# EAGLE board EEZ DIB SMX46 r1B3 (EAGLE 7.2.0)
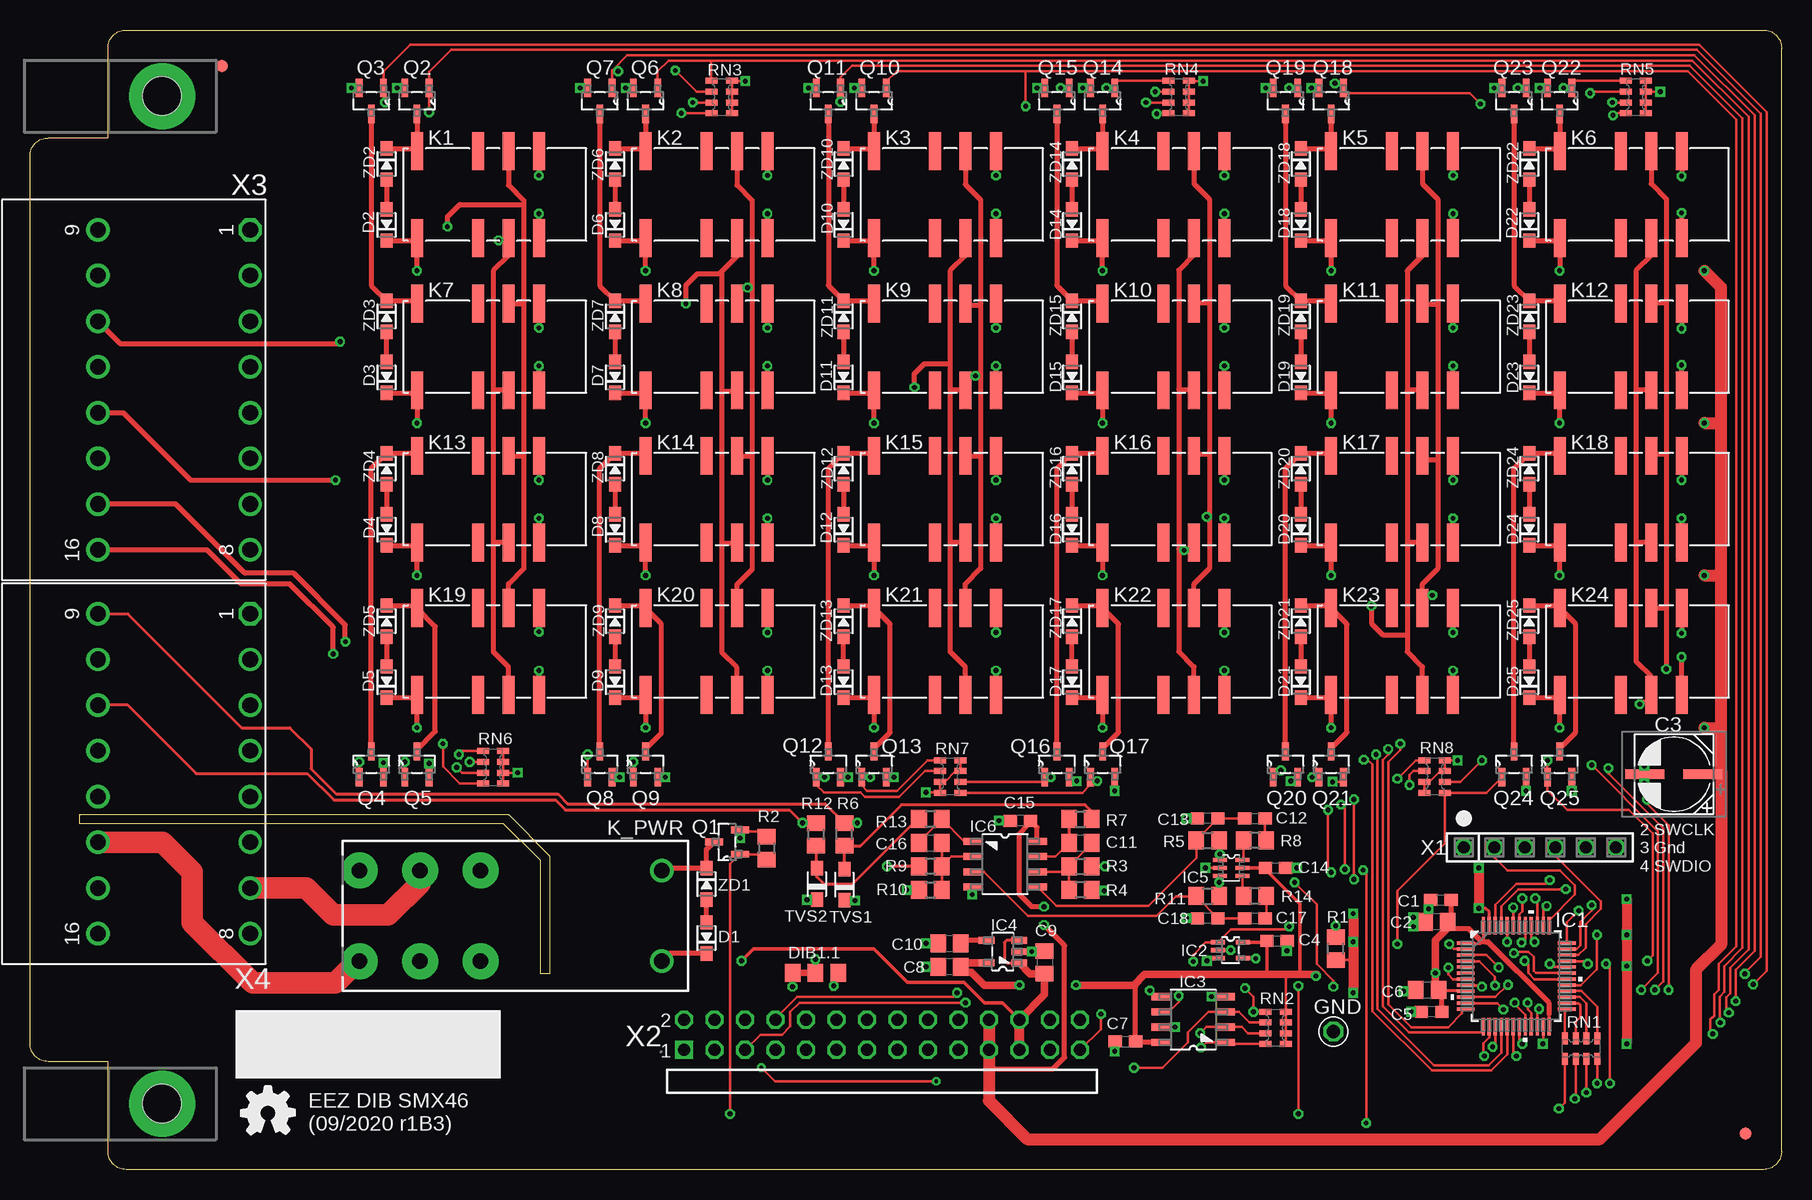
[diagram p3: board, top side]
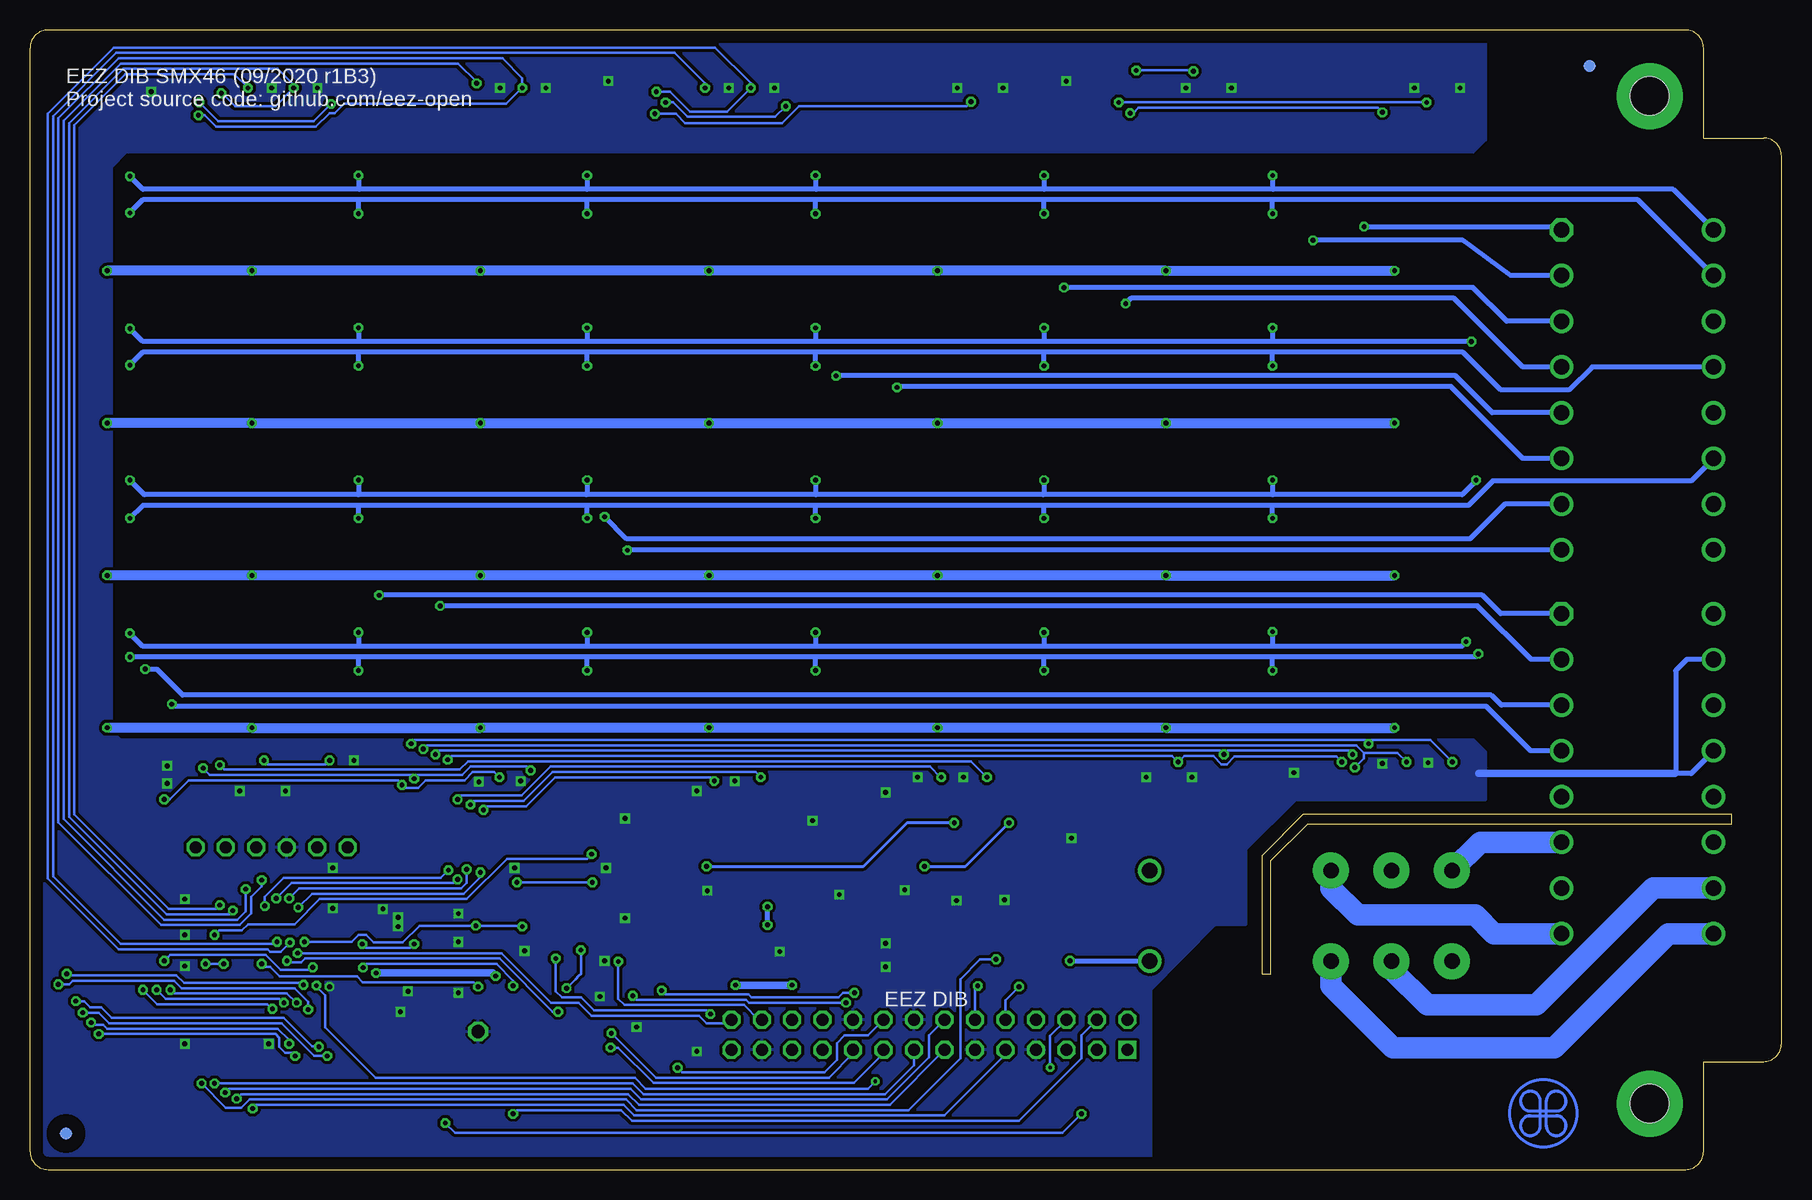
[diagram p4: board, bottom side, seen from below]

Size 146 x 95 mm. Coordinates in mm from the lower left corner, seen from the top.
Outline: 8,95 144.5,95 arc-90 146,93.5 146,1.5 arc-90 144.5,0 8,0 arc-90 6.5,1.5 6.5,9 1.5,9 arc-90 0,10.5 0,84.5 arc-90 1.5,86 6.5,86 6.5,93.5 arc-90 8,95
Outline: 4.13,29.59 39.88,29.59 43.31,26.16 43.31,16.32 42.55,16.32 42.55,25.78 39.5,28.83 4.13,28.83 4.13,29.59
Copper layers (1*16): Top 0.035mm / dielectric 1.5mm / Bottom 0.035mm
Design rules "default *": minimum track width 6mil, minimum drill 0.3mm, track to track 6mil, track to pad 6mil, pad to pad 6mil, via to via 6mil, smd to smd 6mil, copper to edge 40mil, drill to drill 8mil, minimum pad ring 4mil, minimum via ring 8mil, stop-mask expansion 2.5mil, vias tented up to drill 1mm, thermal gap 8mil
Net classes: 0 default: width 0.203 mm, drill 0.3 mm, clearance 0.203 mm; 1 lvds: width 0.152 mm, drill 0.3 mm, clearance 0.152 mm to class 0, clearance 0.152 mm; 2 gnd: width 0.254 mm, drill 0.584 mm, clearance 0.254 mm; 3 diff_in: width 0.254 mm, drill 0.584 mm, clearance 0.203 mm to class 0, clearance 0.203 mm to class 1, clearance 0.203 mm to class 2, clearance 0.203 mm
vRestrict: area 0,0 to 42,14; area 53,0 to 128,8.5

## Footprints (pad centres in the part's own frame; a part is rotated, then mirrored left to right if it is on the bottom)
C0603 = smd 1.1 x 1: 1 -0.85,0; 2 0.85,0
C0805 = smd 1.3 x 1.5: 1 -0.95,0; 2 0.95,0
CAPAE660X610N = smd 3.251 x 0.762: 1 -2.413,0; 2 2.413,0
SOD323-R = smd 1.2 x 1: A 1.3,0; C -1.3,0
JP3-0805-CUT2 = smd 1.3 x 1.5: COM 0,0; NC 1.9,0; NO -1.9,0
FIDUCIAL_DUAL = smd 1.016 x 1.016 bottom: B 0,0 | smd 1.016 x 1.016: T 0,0
PCB_SHIELD_TAB = drill 1.1 octagon: 1 0,0
LQFP-48 = smd 1.473 x 0.279: 1 -4.216,2.743; 2 -4.216,2.261; 3 -4.216,1.753; 4 -4.216,1.245; 5 -4.216,0.762; 6 -4.216,0.254; 7 -4.216,-0.254; 8 -4.216,-0.762; 9 -4.216,-1.245; 10 -4.216,-1.753; 11 -4.216,-2.261; 12 -4.216,-2.743; 25 4.216,-2.743; 26 4.216,-2.261; 27 4.216,-1.753; 28 4.216,-1.245; 29 4.216,-0.762; 30 4.216,-0.254; 31 4.216,0.254; 32 4.216,0.762; 33 4.216,1.245; 34 4.216,1.753; 35 4.216,2.261; 36 4.216,2.743 | smd 0.279 x 1.473: 13 -2.743,-4.216; 14 -2.261,-4.216; 15 -1.753,-4.216; 16 -1.245,-4.216; 17 -0.762,-4.216; 18 -0.254,-4.216; 19 0.254,-4.216; 20 0.762,-4.216; 21 1.245,-4.216; 22 1.753,-4.216; 23 2.261,-4.216; 24 2.743,-4.216; 37 2.743,4.216; 38 2.261,4.216; 39 1.753,4.216; 40 1.245,4.216; 41 0.762,4.216; 42 0.254,4.216; 43 -0.254,4.216; 44 -0.762,4.216; 45 -1.245,4.216; 46 -1.753,4.216; 47 -2.261,4.216; 48 -2.743,4.216
SOT65P210X110-5N = smd 1.168 x 0.356: 1 -1.041,0.66; 2 -1.041,0; 3 -1.041,-0.66; 4 1.041,-0.66; 5 1.041,0.66
SOIC127P600X173-8N = smd 1.55 x 0.6: 1 -2.7,1.9; 2 -2.7,0.63; 3 -2.7,-0.64; 4 -2.7,-1.91; 5 2.7,-1.91; 6 2.7,-0.64; 7 2.7,0.63; 8 2.7,1.9
SOT95P270X145-5N = smd 1.321 x 0.559: 1 -1.372,0.94; 2 -1.372,0; 3 -1.372,-0.94; 4 1.372,-0.94; 5 1.372,0.94
SOT65P210X110-6N = smd 1.168 x 0.356: 1 -0.94,0.66; 2 -0.94,0; 3 -0.94,-0.66; 4 0.94,-0.66; 5 0.94,0; 6 0.94,0.66
FTR-C1 = smd 1 x 3.16: 1 -6.35,-3.62; 3 -1.27,-3.62; 4 1.27,-3.62; 5 3.81,-3.62; 8 3.81,3.62; 9 1.27,3.62; 10 -1.27,3.62; 12 -6.35,3.62
RT-C/016A5_ROUND = drill 1.3 pad 3: 11A 8.83,3.78; 11B 8.83,-3.78; 12A 3.79,3.78; 12B 3.79,-3.78; 14A 13.87,3.78; 14B 13.87,-3.78 | drill 1.3: A1 -11.33,-3.78; A2 -11.33,3.78
PCB-MB = hole 3.2: 0,0
SOT103P240X110-3N = smd 1.524 x 0.559: 1 -1.079,1.016; 2 -1.079,-1.016; 3 1.079,0
R0805 = smd 1.3 x 1.5: 1 -0.95,0; 2 0.95,0
CAY16 = smd 0.5 x 1: 1 -1.35,-0.85; 2 -0.45,-0.85; 3 0.45,-0.85; 4 1.35,-0.85; 5 1.35,0.85; 6 0.45,0.85; 7 -0.45,0.85; 8 -1.35,0.85
SOD323-BIDIR = smd 1.2 x 1: 1 -1.3,0; 2 1.3,0
SSW-106-02-S-S = drill 1 pad 1.5 octagon: 1 -6.35,0; 2 -3.81,0; 3 -1.27,0; 4 1.27,0; 5 3.81,0; 6 6.35,0
77317-104-28LF = drill 1 pad 1.5 square: 1 -33.02,-2.54 | drill 1 pad 1.5 octagon: 2 -33.02,0; 3 -30.48,-2.54; 4 -30.48,0; 5 -27.94,-2.54; 6 -27.94,0; 7 -25.4,-2.54; 8 -25.4,0; 9 -22.86,-2.54; 10 -22.86,0; 11 -20.32,-2.54; 12 -20.32,0; 13 -17.78,-2.54; 14 -17.78,0; 15 -15.24,-2.54; 16 -15.24,0; 17 -12.7,-2.54; 18 -12.7,0; 19 -10.16,-2.54; 20 -10.16,0; 21 -7.62,-2.54; 22 -7.62,0; 23 -5.08,-2.54; 24 -5.08,0; 25 -2.54,-2.54; 26 -2.54,0; 27 0,-2.54; 28 0,0
691327310016 = drill 1.3 octagon: 1 -13.335,6.35 | drill 1.3: 2 -9.525,6.35; 3 -5.715,6.35; 4 -1.905,6.35; 5 1.905,6.35; 6 5.715,6.35; 7 9.525,6.35; 8 13.335,6.35; 9 -13.335,-6.35; 10 -9.525,-6.35; 11 -5.715,-6.35; 12 -1.905,-6.35; 13 1.905,-6.35; 14 5.715,-6.35; 15 9.525,-6.35; 16 13.335,-6.35

## Placement (x,y rotation side)
C1  100n  [C0603]  117.6,22.48 0 top
C2  2u2  [C0805]  117.22,20.64 180 top
C3  EEEFK1V470P  [CAPAE660X610N]  137.03,32.96 180 top
C4  100n  [C0603]  103.95,19.05 0 top
C5  100n  [C0603]  116.84,13.14 180 top
C6  2u2  [C0805]  116.46,14.99 0 top
C7  100n  [C0603]  91.31,10.67 0 top
C8  2u2  [C0805]  76.64,16.89 180 top
C9  2u2  [C0805]  84.58,17.27 270 top
C10  10n  [C0805]  76.64,18.86 0 top
C11  100p  [C0805]  87.57,27.24 0 top
C12  100n  [C0603]  102.11,29.27 0 top
C13  100n  [C0603]  98.17,29.27 180 top
C14  100n  [C0603]  103.82,25.15 0 top
C15  100n  [C0603]  82.55,29.08 180 top
C16  100p  [C0805]  75.06,27.24 0 top
C17  100n  [C0603]  102.11,20.95 0 top
C18  100n  [C0603]  98.17,20.95 180 top
D1  BAS316  [SOD323-R]  56.39,19.3 90 top
D2  BAS316  [SOD323-R]  29.72,78.74 90 top
D3  BAS316  [SOD323-R]  29.72,66.04 90 top
D4  BAS316  [SOD323-R]  29.72,53.34 90 top
D5  BAS316  [SOD323-R]  29.72,40.64 90 top
D6  BAS316  [SOD323-R]  48.77,78.74 90 top
D7  BAS316  [SOD323-R]  48.77,66.04 90 top
D8  BAS316  [SOD323-R]  48.77,53.34 90 top
D9  BAS316  [SOD323-R]  48.77,40.64 90 top
D10  BAS316  [SOD323-R]  67.82,78.74 90 top
D11  BAS316  [SOD323-R]  67.82,66.04 90 top
D12  BAS316  [SOD323-R]  67.82,53.34 90 top
D13  BAS316  [SOD323-R]  67.82,40.64 90 top
D14  BAS316  [SOD323-R]  86.87,78.74 90 top
D15  BAS316  [SOD323-R]  86.87,66.04 90 top
D16  BAS316  [SOD323-R]  86.87,53.34 90 top
D17  BAS316  [SOD323-R]  86.87,40.64 90 top
D18  BAS316  [SOD323-R]  105.92,78.74 90 top
D19  BAS316  [SOD323-R]  105.92,66.04 90 top
D20  BAS316  [SOD323-R]  105.92,53.34 90 top
D21  BAS316  [SOD323-R]  105.92,40.64 90 top
D22  BAS316  [SOD323-R]  124.97,78.74 90 top
D23  BAS316  [SOD323-R]  124.97,66.04 90 top
D24  BAS316  [SOD323-R]  124.97,53.34 90 top
D25  BAS316  [SOD323-R]  124.97,40.64 90 top
DIB1.1  JP3-CUT-0805-ROTATED  [JP3-0805-CUT2]  65.47,16.38 180 top
EEZ_SIGNATURE  SIGNATURESMALL  [SIGNATURE_5MM]  19.86,4.68 180 top
FM1  FIDUCIAL_2  [FIDUCIAL_DUAL]  16,92 0 top
FM2  FIDUCIAL_2  [FIDUCIAL_DUAL]  143,3 0 top
GND  [PCB_SHIELD_TAB]  108.65,11.49 0 top
IC1  STM32F030C6T6  [LQFP-48]  123.89,16.13 0 top
IC2  74HC1G126GW,125  [SOT65P210X110-5N]  100.08,18.29 0 top
IC3  M24C32-WMN6P  [SOIC127P600X173-8N]  96.96,12.51 180 top
IC4  LP2985-33DBVR  [SOT95P270X145-5N]  81.09,18.16 180 top
IC5  74HC2G04GW,125  [SOT65P210X110-6N]  100.14,25.15 0 top
IC6  OPA2990IDR  [SOIC127P600X173-8N]  81.28,25.46 0 top
K1  FTR-C1GA012G-B05  [FTR-C1]  38.61,81.28 0 top
K2  FTR-C1GA012G-B05  [FTR-C1]  57.66,81.28 0 top
K3  FTR-C1GA012G-B05  [FTR-C1]  76.71,81.28 0 top
K4  FTR-C1GA012G-B05  [FTR-C1]  95.76,81.28 0 top
K5  FTR-C1GA012G-B05  [FTR-C1]  114.81,81.28 0 top
K6  FTR-C1GA012G-B05  [FTR-C1]  133.86,81.28 0 top
K7  FTR-C1GA012G-B05  [FTR-C1]  38.61,68.58 0 top
K8  FTR-C1GA012G-B05  [FTR-C1]  57.66,68.58 0 top
K9  FTR-C1GA012G-B05  [FTR-C1]  76.71,68.58 0 top
K10  FTR-C1GA012G-B05  [FTR-C1]  95.76,68.58 0 top
K11  FTR-C1GA012G-B05  [FTR-C1]  114.81,68.58 0 top
K12  FTR-C1GA012G-B05  [FTR-C1]  133.86,68.58 0 top
K13  FTR-C1GA012G-B05  [FTR-C1]  38.61,55.88 0 top
K14  FTR-C1GA012G-B05  [FTR-C1]  57.66,55.88 0 top
K15  FTR-C1GA012G-B05  [FTR-C1]  76.71,55.88 0 top
K16  FTR-C1GA012G-B05  [FTR-C1]  95.76,55.88 0 top
K17  FTR-C1GA012G-B05  [FTR-C1]  114.81,55.88 0 top
K18  FTR-C1GA012G-B05  [FTR-C1]  133.86,55.88 0 top
K19  FTR-C1GA012G-B05  [FTR-C1]  38.61,43.18 0 top
K20  FTR-C1GA012G-B05  [FTR-C1]  57.66,43.18 0 top
K21  FTR-C1GA012G-B05  [FTR-C1]  76.71,43.18 0 top
K22  FTR-C1GA012G-B05  [FTR-C1]  95.76,43.18 0 top
K23  FTR-C1GA012G-B05  [FTR-C1]  114.81,43.18 0 top
K24  FTR-C1GA012G-B05  [FTR-C1]  133.86,43.18 0 top
K_PWR  RT424005  [RT-C/016A5_ROUND]  41.34,21.15 180 top
KK1  PCB-MB  [PCB-MB]  11,89.5 0 top
KK2  PCB-MB  [PCB-MB]  11,5.5 0 top
Q1  2N7002  [SOT103P240X110-3N]  58.1,27.3 180 top
Q2  2N7002  [SOT103P240X110-3N]  32.26,89.09 270 top
Q3  2N7002  [SOT103P240X110-3N]  28.45,89.09 270 top
Q4  2N7002  [SOT103P240X110-3N]  28.45,33.78 90 top
Q5  2N7002  [SOT103P240X110-3N]  32.26,33.78 90 top
Q6  2N7002  [SOT103P240X110-3N]  51.31,89.09 270 top
Q7  2N7002  [SOT103P240X110-3N]  47.5,89.09 270 top
Q8  2N7002  [SOT103P240X110-3N]  47.5,33.78 90 top
Q9  2N7002  [SOT103P240X110-3N]  51.31,33.78 90 top
Q10  2N7002  [SOT103P240X110-3N]  70.36,89.09 270 top
Q11  2N7002  [SOT103P240X110-3N]  66.55,89.09 270 top
Q12  2N7002  [SOT103P240X110-3N]  66.55,33.78 90 top
Q13  2N7002  [SOT103P240X110-3N]  70.36,33.78 90 top
Q14  2N7002  [SOT103P240X110-3N]  89.41,89.09 270 top
Q15  2N7002  [SOT103P240X110-3N]  85.6,89.09 270 top
Q16  2N7002  [SOT103P240X110-3N]  85.6,33.78 90 top
Q17  2N7002  [SOT103P240X110-3N]  89.41,33.78 90 top
Q18  2N7002  [SOT103P240X110-3N]  108.46,89.09 270 top
Q19  2N7002  [SOT103P240X110-3N]  104.65,89.09 270 top
Q20  2N7002  [SOT103P240X110-3N]  104.65,33.78 90 top
Q21  2N7002  [SOT103P240X110-3N]  108.46,33.78 90 top
Q22  2N7002  [SOT103P240X110-3N]  127.51,89.09 270 top
Q23  2N7002  [SOT103P240X110-3N]  123.7,89.09 270 top
Q24  2N7002  [SOT103P240X110-3N]  123.7,33.78 90 top
Q25  2N7002  [SOT103P240X110-3N]  127.51,33.78 90 top
R1  10K  [R0805]  108.84,18.41 90 top
R2  47K  [R0805]  61.4,26.8 270 top
R3  10K  [R0805]  87.57,25.27 0 top
R4  4K7  [R0805]  87.57,23.3 180 top
R5  10K  [R0805]  98.17,27.43 0 top
R6  47R  [R0805]  67.88,27.94 90 top
R7  180R  [R0805]  87.57,29.21 0 top
R8  10K  [R0805]  102.11,27.43 180 top
R9  10K  [R0805]  75.06,25.27 180 top
R10  4K7  [R0805]  75.06,23.3 0 top
R11  10K  [R0805]  98.17,22.8 0 top
R12  47R  [R0805]  65.53,27.94 90 top
R13  180R  [R0805]  75.06,29.21 180 top
R14  10K  [R0805]  102.11,22.8 180 top
RN1  DR1206-33R-4/8  [CAY16]  129.29,10.1 180 top
RN2  DR1206-10K-4/8  [CAY16]  103.82,11.81 270 top
RN3  DR1206-47K-4/8  [CAY16]  57.66,89.41 90 top
RN4  DR1206-47K-4/8  [CAY16]  95.76,89.41 90 top
RN5  DR1206-47K-4/8  [CAY16]  133.86,89.41 90 top
RN6  DR1206-47K-4/8  [CAY16]  38.61,33.53 90 top
RN7  DR1206-47K-4/8  [CAY16]  76.71,32.77 90 top
RN8  DR1206-47K-4/8  [CAY16]  117.09,32.77 90 top
TVS1  PESD12VL1BA.115  [SOD323-BIDIR]  67.88,23.75 90 top
TVS2  PESD12VL1BA.115  [SOD323-BIDIR]  65.6,23.81 90 top
X1  N.C.  [SSW-106-02-S-S]  125.86,26.86 0 top
X2  77317-104-28LF  [77317-104-28LF]  87.54,12.5 0 top
X3  691327310016  [691327310016]  12,65 270 top
X4  691327310016  [691327310016]  12,33 270 top
ZD1  MM3Z18VT1G  [SOD323-R]  56.39,23.81 270 top
ZD2  MM3Z18VT1G  [SOD323-R]  29.72,83.82 270 top
ZD3  MM3Z18VT1G  [SOD323-R]  29.72,71.12 270 top
ZD4  MM3Z18VT1G  [SOD323-R]  29.72,58.42 270 top
ZD5  MM3Z18VT1G  [SOD323-R]  29.72,45.72 270 top
ZD6  MM3Z18VT1G  [SOD323-R]  48.77,83.82 270 top
ZD7  MM3Z18VT1G  [SOD323-R]  48.77,71.12 270 top
ZD8  MM3Z18VT1G  [SOD323-R]  48.77,58.42 270 top
ZD9  MM3Z18VT1G  [SOD323-R]  48.77,45.72 270 top
ZD10  MM3Z18VT1G  [SOD323-R]  67.82,83.82 270 top
ZD11  MM3Z18VT1G  [SOD323-R]  67.82,71.12 270 top
ZD12  MM3Z18VT1G  [SOD323-R]  67.82,58.42 270 top
ZD13  MM3Z18VT1G  [SOD323-R]  67.82,45.72 270 top
ZD14  MM3Z18VT1G  [SOD323-R]  86.87,83.82 270 top
ZD15  MM3Z18VT1G  [SOD323-R]  86.87,71.12 270 top
ZD16  MM3Z18VT1G  [SOD323-R]  86.87,58.42 270 top
ZD17  MM3Z18VT1G  [SOD323-R]  86.87,45.72 270 top
ZD18  MM3Z18VT1G  [SOD323-R]  105.92,83.82 270 top
ZD19  MM3Z18VT1G  [SOD323-R]  105.92,71.12 270 top
ZD20  MM3Z18VT1G  [SOD323-R]  105.92,58.42 270 top
ZD21  MM3Z18VT1G  [SOD323-R]  105.92,45.72 270 top
ZD22  MM3Z18VT1G  [SOD323-R]  124.97,83.82 270 top
ZD23  MM3Z18VT1G  [SOD323-R]  124.97,71.12 270 top
ZD24  MM3Z18VT1G  [SOD323-R]  124.97,58.42 270 top
ZD25  MM3Z18VT1G  [SOD323-R]  124.97,45.72 270 top

## Tracks (layer width: path | path; a pad name or v marks a point on that pad's centre or on a via)
+3V3  (via drill 0.4)
  Top 0.203: RN2.5 RN2.6 RN2.7 RN2.8 104.67,16.17 104.33,16.26
  Top 0.254: IC1.24 126.63,12.94 | IC1.48 121.14,19.13 121.28,18.99 | IC1.1 120.92,18.87 121.03,18.99 | 117.54,15.37 117.16,14.99 | IC1.9 117.51,14.88 C6.2
  Top 0.305: 103.06,16.26 103.1,16.3 C4.1 103.1,18.95 IC2.5 | 101.69,16.23 101.66,16.26 | IC5.5 C14.1 103,25.15 103,25.02 105.86,22.16 105.86,16.32 105.79,16.26
  Top 0.406: 126.63,12.94 126.63,13.89 121.54,18.99 121.28,18.99 121.03,18.99 119.95,20.07 118.62,20.07 C2.1 | C2.1 118.37,20.95 118.43,20.89 | IC3.8 92.22,10.61 C7.2 92.16,15.22 92.01,15.37 | 117.18,14.71 C6.2 117.69,14.71 C5.1 | C1.2 118.45,20.91 C2.1
  Top 0.61: C2.1 118.11,20.07 117.16,19.11 v117.16,16.38 117.16,14.99 C6.2 | v107.19,16.13 107.25,16.26 105.79,16.26 104.33,16.26 103.06,16.26 101.66,16.26 92.9,16.26 92.01,15.37 v87.19,15.37 | C8.1 77.59,16.7 77.78,16.7 | IC4.5 77.92,17.22 C8.1 | v82.49,15.37 79.57,15.37 78.49,16.45 77.85,16.45 77.85,16.63 C8.1
  Bottom 0.61: v87.19,15.37 v82.49,15.37 | v117.16,16.38 107.44,16.38 v107.19,16.13
+5V  (via drill 0.4)
  Top 0.254: 82.43,17.19 IC4.1 82.45,17.21 81.41,17.21 81.22,17.4 81.22,18.92 81.39,19.1 IC4.3
  Top 0.305: v59.31,17.4 60.33,18.41 70.36,18.41 73.15,15.62 77.85,15.62 79.57,13.91 81.05,13.91 X2.24
  Top 0.406: D1.C 53.31,18 K_PWR.A2
  Top 0.61: X2.24 84.58,14.62 C9.2 83.36,16.32 IC4.1
  Top 0.813: X2.23 X2.24
  Bottom 0.406: v59.31,17.4 52.7,17.4 K_PWR.A2
+12V  (via drill 0.4)
  Top 0.254: C3.1 140.72,32.96 140.97,33.21
  Top 0.406: D8.C 50.8,52.04 | 50.8,52.04 51.09,52.04 K14.1 | D10.C 70.14,77.44 K3.1 v70.36,74.93 | D23.C 127.29,64.74 K12.1 v127.51,62.23 | D19.C 108.24,64.74 K11.1 v108.46,62.23 | D15.C 89.19,64.74 K10.1 v89.41,62.23 | v32.26,62.23 K7.1 32.04,64.74 D3.C | v51.31,62.23 K8.1 51.09,64.74 D7.C | v70.36,62.23 K9.1 70.14,64.74 D11.C | v32.26,36.83 K19.1 32.04,39.34 D5.C | D25.C 127.29,39.34 K24.1 v127.51,36.83 | D21.C 108.24,39.34 K23.1 v108.46,36.83 | D17.C 89.19,39.34 K22.1 v89.41,36.83 | D13.C 70.14,39.34 K21.1 v70.36,36.83 | D9.C 51.09,39.34 K20.1 v51.31,36.83 | v32.26,49.53 K13.1 32.04,52.04 D4.C | D24.C 127.29,52.04 K18.1 v127.51,49.53 | D20.C 108.24,52.04 K17.1 v108.46,49.53 | D16.C 89.19,52.04 K16.1 v89.41,49.53 | D12.C 70.14,52.04 K15.1 v70.36,49.53 | v32.26,74.93 K1.1 32.04,77.44 D2.C | v127.51,74.93 K6.1 127.29,77.44 D22.C | v108.46,74.93 K5.1 108.24,77.44 D18.C | v89.41,74.93 K4.1 89.19,77.44 D14.C | v51.31,74.93 K2.1 51.09,77.44 D6.C | v51.31,49.53 51.31,51.53 50.8,52.04 | IC6.8 83.95,27.4 83.95,28.54 C15.1 83.29,29 83.29,28.8 82.42,27.94 82.42,22.99 83.5,21.91 v84.52,21.91 | X2.21 79.92,8.41 79.95,8.38 85.28,8.38 86.23,9.34 86.23,18.67 v84.52,20.38
  Top 1.016: 140.97,36.83 140.97,33.21 140.97,18.73 138.88,16.64 138.88,10.54 130.87,2.54 83.12,2.54 79.92,5.74 X2.21 X2.22 | 140.97,36.83 140.97,49.53 | v139.57,36.83 140.97,36.83 | v139.57,49.53 140.97,49.53 | 140.97,49.53 140.97,62.23 | 140.97,62.23 140.97,73.53 v139.57,74.93 | v139.57,62.23 140.97,62.23
  Bottom 0.406: v84.52,20.38 v84.52,21.91
  Bottom 0.813: v32.26,62.23 v51.31,62.23 v70.36,62.23 v89.41,62.23 v108.46,62.23 v127.51,62.23 v139.57,62.23 | v32.26,36.83 v51.31,36.83 v70.36,36.83 v89.41,36.83 v108.46,36.83 v127.51,36.83 v139.57,36.83 | v32.26,49.53 v51.31,49.53 v70.36,49.53 v89.41,49.53 v108.46,49.53 v127.51,49.53 v139.57,49.53 | v32.26,74.93 v51.31,74.93 v70.36,74.93 v89.41,74.93 v108.46,74.93 v127.51,74.93 v139.57,74.93
BOOT0  (via drill 0.4)
  Top 0.203: IC1.44 v123.13,18.99 | R1.2 v108.84,20.32 | v104.97,20.26 104.71,20 100.09,20 IC2.1 99.01,18.92 97.98,18.92 96.97,17.91 v96.97,17.34
  Bottom 0.203: v123.13,18.99 119.19,18.99 118.62,19.56 117.98,19.56 117.35,18.92 114.94,18.92 113.54,20.32 v108.84,20.32 105.03,20.32 v104.97,20.26 | X2.26 85.27,12.5 86.49,13.72 96.46,13.72 96.97,14.22 v96.97,17.34
DAC#1
  Top 0.203: C12.1 C13.1 97.22,27.47 R5.1 97.22,25.97 93.22,21.97 85.56,21.97 IC6.5
DAC#2
  Top 0.203: C17.1 C18.1 97.22,22.75 | R11.1 97.22,22.75 | 97.22,22.75 95.53,22.75 93.92,21.14 83.19,21.14 79.5,24.83 IC6.3
DIB_A0  (via drill 0.4)
  Top 0.203: RN2.4 99.81,10.46 IC3.1 98.05,10.61 v97.6,10.16
  Bottom 0.203: v97.6,10.16 96.97,10.16 94.02,7.21 77.32,7.21 74.84,9.69 X2.17
DIB_A1  (via drill 0.4)
  Top 0.203: RN2.3 101.54,11.37 101.02,11.88 IC3.2 98.05,11.88 v97.54,11.37
  Bottom 0.203: v97.54,11.37 93.83,7.66 79.42,7.66 77.38,9.69 X2.19
DIB_A2  (via drill 0.4)
  Top 0.203: RN2.2 101.66,12.26 100.77,13.15 IC3.3 98.24,13.15 96.52,11.43 96.52,10.6 94.4,8.48 v92.02,8.48
  Bottom 0.203: X2.18 76.16,11.18 78.11,11.18 78.74,10.54 78.74,9.13 79.77,8.1 91.64,8.1 v92.02,8.48
DIB_CSA
  Top 0.203: RN1.4 127.94,13.32 IC1.25
DIB_CSB  (via drill 0.4)
  Top 0.203: DIB1.1.NO 67.25,16.26 67.25,15.56 v66.99,15.3
  Bottom 0.203: X2.12 67.22,15.08 v66.99,15.3
DIB_IRQ  (via drill 0.4)
  Top 0.203: v63.56,15.24 DIB1.1.NC
  Bottom 0.203: X2.10 64.68,14.12 v63.56,15.24
DIB_MISO
  Top 0.203: RN1.2 129.74,13.84 129.2,14.38 IC1.27
DIB_MOSI
  Top 0.203: RN1.1 130.64,13.57 129.32,14.88 IC1.28
DIB_NRESET  (via drill 0.4)
  Top 0.203: v105.73,15.3 v105.73,4.64 | IC1.7 118.62,15.88 118.24,16.26 v118.24,16.83
  Bottom 0.203: X2.4 58.36,11.2 58.36,9.27 63.56,4.06 95.82,4.06 96.71,4.95 105.41,4.95 v105.73,4.64 | v118.24,16.83 117.92,17.14 107.12,17.14 105.73,15.75 v105.73,15.3
DIB_SCL  (via drill 0.4)
  Top 0.203: X2.5 59.62,9.96 60.9,11.24 62.67,11.24 63.37,11.94 63.37,13.14 64.14,13.91 v77.98,13.91 | IC3.6 94.94,13.15 95.76,13.97 v95.76,14.48
  Bottom 0.203: v77.98,13.91 86.04,13.91 86.3,14.16 95.44,14.16 v95.76,14.48
DIB_SCLK
  Top 0.203: RN1.3 128.84,12.31 129.22,12.7 129.22,13.72 129.07,13.87 IC1.26
DIB_SDA  (via drill 0.4)
  Top 0.203: X2.8 62.14,12.61 63.94,14.41 76.96,14.41 v77.28,14.73 | IC3.5 93.85,14.42 v93.34,14.92
  Bottom 0.203: v93.34,14.92 93.03,14.61 86.11,14.61 85.85,14.35 78.61,14.35 78.23,14.73 v77.28,14.73
DIB_SYNC  (via drill 0.3, 0.4)
  Top 0.203: IC1.4 120.8,17.37 122.12,16.05 v122.12,15.34 | v75.53,7.35 62.1,7.35 v60.97,8.48
  Bottom 0.203: v122.12,15.34 122.12,15.23 121.4,14.5 121.4,11.84 117.2,7.63 95.57,7.63 94.68,6.74 76.14,6.74 v75.53,7.35 | v60.97,8.48 60.97,11.13 X2.6
GND  (via drill 0.4)
  Top 0.203: v59.63,90.74 58.51,90.74 RN3.4 RN3.3 RN3.2 RN3.1 | v97.79,90.74 96.61,90.74 RN4.4 RN4.3 RN4.2 RN4.1 | RN5.4 RN5.3 | v135.89,89.85 RN5.3 | RN5.1 RN5.2 RN5.3 | RN6.1 RN6.2 | RN6.2 RN6.3 RN6.4 | RN6.2 v40.63,33.08 v40.64,33.08 | RN7.4 RN7.3 77.16,33.22 76.26,32.32 RN7.7 RN7.8 75.84,31.43 v74.68,31.43 | R2.1 61.4,28.19 59.31,28.19 Q1.2 | C2.2 116.08,20.57 v115.32,20.26 | v68.77,22.42 67.92,22.42 TVS1.1 | TVS2.1 64.8,22.51 v64.77,22.48 | R10.1 v73.09,23.3 | IC5.2 v97.98,25.15 | v105.6,25.15 C14.2 | C4.2 v104.78,18.22 | C13.2 v96.39,29.27 | C18.2 v96.39,20.95 | IC3.4 v98.49,14.42 v98.49,14.41 | v87.25,32.38 86.61,32.38 Q16.2 | Q17.2 v90.42,31.56 | IC1.23 126.15,10.45 v126.11,10.48 | v108.58,32.32 109.47,32.32 Q21.2 | v105.09,32.38 105.66,32.38 Q20.2 | C1.1 v116.59,21.72 | v119,34.1 117.96,34.1 RN8.4 RN8.3 117.54,33.22 116.64,32.32 RN8.7 RN8.8 | R1.1 110.3,17.46 110.3,17.4
  Top 0.254: Q3.2 v26.8,90.17 | C3.2 134.62,33.59 v134.56,33.66 | IC1.47 121.63,21.5 121.35,21.78 v120.78,21.78 | C6.1 114.62,14.99 v114.49,14.86 | C5.2 v115.13,13.14 | IC1.8 121.03,15.37 v121.03,15.24
  Top 0.305: Q1.2 v59.18,27.62 | IC2.3 98.11,17.63 v98.11,17.4 | v83.5,18.16 84.52,18.16 C9.1
  Top 0.406: v30.61,90.17 Q2.2 | v45.85,90.17 Q7.2 | v49.66,90.17 Q6.2 | v64.9,90.17 Q11.2 | v68.71,90.17 Q10.2 | v83.95,90.17 Q15.2 | v87.76,90.17 Q14.2 | v103,90.17 Q19.2 | v106.81,90.17 Q18.2 | v122.05,90.17 Q23.2 | v125.86,90.17 Q22.2 | Q4.2 v29.46,33.91 | Q5.2 v33.27,33.85 | Q25.2 v128.52,31.56 | Q24.2 v124.71,31.56 | Q13.2 v72.01,32.7 | Q12.2 v68.2,32.7 | Q9.2 v52.96,32.7 | Q8.2 v49.15,32.7 | C10.1 v74.68,18.86 | C8.2 v74.68,16.89 | C15.2 v80.77,29.08 | R4.1 v89.53,23.24 | IC6.4 78.58,22.95 v78.55,22.92 | C7.1 v90.42,9.84 | IC3.7 v95.44,11.88 v95.44,11.87 | IC4.2 v83.5,18.16
  Top 0.813: v133.1,10.48 v133.1,16.95 v133.1,19.56 v133.1,22.54 | v110.3,21.34 v110.3,18.99 110.3,17.4 v110.3,14.73 | v120.78,25.15 v120.78,21.78
  Bottom 0.406: X4.10 7.89,42.52 8.83,41.59 8.83,33.08 8.89,33.02 7.54,33.02 X4.12
  Bottom 0.61: 8.89,33.02 25.21,33.02
  other vias: 134.56,32.19 115.32,21.02
  pour Bottom (isolate 0.254): 24.64,95.25 146.05,95.25 146.05,-0.76 52.58,-0.76 52.58,14.99 47.18,20.45 44.64,20.45 44.64,26.67 40.45,30.86 24.64,30.86 24.64,34.8 25.65,35.81 138.43,35.81 139.19,36.58 139.19,83.57 137.92,84.84 25.65,84.84 24.64,85.85
HOLE_DL  (via drill 3.2 pad 5.5)
  other vias: 11,5.5
HOLE_UL  (via drill 3.2 pad 5.5)
  other vias: 11,89.5
ISET1
  Top 0.203: R7.2 88.52,29.15
  Top 0.254: R7.2 88.52,29.84 87.95,30.42 72.64,30.42 69.22,26.99 R6.1 TVS1.2
ISET2
  Top 0.254: R12.1 65.53,25.18 TVS2.2 65.6,24.38 66.17,23.81 68.58,23.81 73.98,29.21 R13.2
K_PWR  (via drill 0.4)
  Top 0.203: R2.2 60.96,26.29 Q1.1 58.36,25.46 v58.36,4.64 | IC1.38 126.15,21.69 v126.43,21.97 | v111.12,24.96 111.38,24.7 v111.38,3.87
  Bottom 0.203: v58.36,4.64 59.94,3.05 110.55,3.05 v111.38,3.87 | v126.43,21.97 126.43,22.73 124.84,24.32 111.76,24.32 v111.12,24.96
N$1  (via drill 0.4)
  Top 0.406: 38.61,64.9 38.61,74.93 39.88,76.2 K1.4 39.88,77.47 v39.05,77.47 | 38.61,64.9 38.61,52.26 | 38.61,52.26 38.61,43.18 39.88,41.91 K19.4 | K13.4 38.61,52.26 | K7.4 38.67,64.96 38.61,64.9
  Bottom 0.406: X3.2 22.58,74.53 26.54,77.47 v39.05,77.47
N$2  (via drill 0.4)
  Top 0.406: K1.9 39.88,82.04 41.15,80.77 41.15,80.45 | 41.15,80.45 41.15,72.33 | 41.15,72.33 41.15,59.5 | K7.9 41.02,72.2 41.15,72.33 | K13.9 41.15,59.5 | 41.15,59.5 41.15,50.1 39.88,48.83 K19.9 | v34.8,78.61 34.8,79.44 35.81,80.45 41.15,80.45
  Bottom 0.406: v34.8,78.61 18.63,78.61 X3.1
N$3  (via drill 0.4)
  Top 0.406: K17.5 v118.62,54.29 | K16.5 v99.57,54.29 | K15.5 v80.52,54.29 | K14.5 v61.47,54.29 | K13.5 v42.42,54.29 | K18.5 v137.67,54.29
  Bottom 0.406: 42.42,55.37 26.1,55.37 24.07,57.4 7.53,57.4 X3.14 | 42.42,55.37 61.47,55.37 | 61.47,55.37 80.58,55.37 | 80.58,55.37 99.57,55.37 | 99.57,55.37 118.62,55.37 | 118.62,55.37 136.59,55.37 v137.67,54.29 | v118.62,54.29 118.62,55.37 | v99.57,54.29 99.57,55.37 | v80.52,54.29 80.52,55.31 80.58,55.37 | v61.47,54.29 61.47,55.37 | v42.42,54.29 42.42,55.37
N$4  (via drill 0.4)
  Top 0.406: K17.8 v118.62,57.47 | K16.8 v99.57,57.47 | K15.8 v80.52,57.47 | K14.8 v61.47,57.47 | K13.8 v42.42,57.47 | K18.8 v137.67,57.47 | v25.46,57.47 13.4,57.47 7.77,63.09 X3.13
  Bottom 0.406: 42.42,56.26 26.61,56.26 25.46,57.4 v25.46,57.47 | 42.42,56.26 61.53,56.26 | 61.53,56.26 80.52,56.26 | 80.52,56.26 99.63,56.26 | 99.63,56.26 118.62,56.26 | 118.62,56.26 136.46,56.26 v137.67,57.47 | v118.62,57.47 118.62,56.26 | v99.57,57.47 99.57,56.33 99.63,56.26 | v80.52,57.47 80.52,56.26 | v61.47,57.47 61.47,56.33 61.53,56.26 | v42.42,57.47 42.42,56.26
N$6  (via drill 0.4)
  Top 0.406: K10.5 v99.57,66.99 | K9.5 v80.52,66.99 | K8.5 v61.47,66.99 | K7.5 v42.42,66.99 | K11.5 v118.62,66.99 | K12.5 v137.67,67.06
  Bottom 0.406: X3.12 15.79,66.91 17.67,65.02 23.43,65.02 26.54,68.14 42.42,68.14 | 42.42,68.14 61.47,68.14 | 61.47,68.14 80.45,68.14 | 80.45,68.14 99.63,68.14 | 99.63,68.14 118.62,68.14 | 118.62,68.14 136.59,68.14 v137.67,67.06 137.6,66.86 | v99.57,66.99 99.57,68.07 99.63,68.14 | v80.52,66.99 80.52,68.07 80.45,68.14 | v61.47,66.99 61.47,68.14 | v42.42,66.99 42.42,68.14 | v118.62,66.99 118.62,68.14
N$7  (via drill 0.4)
  Top 0.406: K10.8 v99.57,70.17 | K9.8 v80.52,70.17 | K8.8 v61.47,70.17 | K7.8 v42.42,70.17 | K11.8 v118.62,70.17 | K12.8 v137.67,70.1 | v25.84,69.03 25.65,68.83 7.53,68.83 X3.11
  Bottom 0.406: v25.84,69.03 42.42,69.03 | 42.42,69.03 61.47,69.03 | 61.47,69.03 80.45,69.03 | 80.45,69.03 99.63,69.03 | 99.63,69.03 118.68,69.03 | 118.68,69.03 136.59,69.03 v137.67,70.1 | v99.57,70.17 99.57,69.09 99.63,69.03 | v80.52,70.17 80.52,69.09 80.45,69.03 | v61.47,70.17 61.47,69.03 | v42.42,70.17 42.42,69.03 | v118.62,70.17 118.62,69.09 118.68,69.03
N$8
  Top 0.406: ZD4.A D4.A
N$9
  Top 0.406: K13.12 32.04,59.72 ZD4.C 28.45,58.45 Q4.3
N$10  (via drill 0.4)
  Top 0.406: K19.5 v42.42,41.59 | K23.5 v118.62,41.59 | K22.5 v99.57,41.59 | K21.5 v80.52,41.59 | K20.5 v61.47,41.59 | K24.5 v137.67,42.74 | v25.27,42.99 25.27,45.21 21.65,48.83 17.59,48.83 14.76,51.66 X3.16
  Bottom 0.406: 42.48,42.74 25.53,42.74 v25.27,42.99 | 42.48,42.74 61.47,42.74 | 61.47,42.74 80.45,42.74 | 80.45,42.74 99.63,42.74 | 99.63,42.74 118.62,42.74 | 118.62,42.74 v137.67,42.74 | v42.42,41.59 42.42,42.67 42.48,42.74 | v118.62,41.59 118.62,42.74 | v99.57,41.59 99.57,42.67 99.63,42.74 | v80.52,41.59 80.52,42.67 80.45,42.74 | v61.47,41.59 61.47,42.74
N$11  (via drill 0.4)
  Top 0.406: K19.8 v42.42,44.83 | K23.8 v118.62,44.77 | K22.8 v99.57,44.77 | K21.8 v80.52,44.77 | K20.8 v61.47,44.77 | K24.8 v137.67,44.7 | v26.29,44.01 26.29,45.4 21.97,49.72 17.91,49.72 12.13,55.5 5.97,55.5 X3.15
  Bottom 0.406: 42.42,43.62 26.67,43.62 v26.29,44.01 | 42.42,43.62 61.53,43.62 | 61.53,43.62 80.52,43.62 | 80.52,43.62 99.57,43.62 | 99.57,43.62 118.62,43.62 | 118.62,43.62 136.59,43.62 v137.67,44.7 | v42.42,44.83 42.42,43.62 | v118.62,44.77 118.62,43.62 | v99.57,44.77 99.57,43.62 | v80.52,44.77 80.52,43.62 | v61.47,44.77 61.47,43.69 61.53,43.62
N$12  (via drill 0.4)
  Top 0.406: K5.4 116.08,76.2 114.81,74.93 114.81,64.9 | 114.81,64.9 114.81,52.13 | 114.81,52.13 114.81,44.58 | 114.81,44.58 114.81,43.18 116.08,41.91 K23.4 | K11.4 114.87,64.96 114.81,64.9 | K17.4 114.93,52.26 114.81,52.13 | v111.82,46.99 111.82,45.53 112.78,44.58 114.81,44.58
  Bottom 0.406: X4.2 20.87,42.52 25.34,46.99 v111.82,46.99
N$13
  Top 0.406: ZD10.A D10.A
N$14  (via drill 0.4)
  Top 0.406: K2.4 58.93,76.14 57.66,74.87 | 57.66,74.87 57.66,64.83 | 57.66,64.83 57.66,52.2 | 57.66,52.2 57.66,43.12 58.93,41.85 K20.4 | K14.4 58.87,52.2 57.66,52.2 | K8.4 58.8,64.83 57.66,64.83 | v54.67,72.2 54.67,73.72 55.63,74.68 57.47,74.68 57.66,74.87
  Bottom 0.406: X3.4 21.57,66.91 27.3,72.64 54.23,72.64 v54.67,72.2
N$15  (via drill 0.4)
  Top 0.406: K2.9 58.93,82.04 60.2,80.77 60.2,73.53 | 60.2,73.53 60.2,59.5 | 60.2,59.5 60.2,50.04 58.93,48.77 K20.9 | K14.9 60.2,59.5 | K8.9 58.93,73.15 59.31,73.53 v59.82,73.53 60.2,73.53
  Bottom 0.406: X3.3 22.9,70.72 25.72,73.53 v59.82,73.53
N$16  (via drill 0.4)
  Top 0.406: K5.9 116.08,82.17 117.35,80.9 117.35,72.14 | 117.35,72.14 117.35,59.18 | 117.35,59.18 117.35,50.1 116.08,48.83 116.08,47.94 | K17.9 116.4,59.18 117.35,59.18 | K11.9 116.14,72.14 117.35,72.14 | K23.9 116.08,47.94 | v116.9,47.88 116.14,47.88 116.08,47.94
  Bottom 0.406: X4.1 23.41,46.34 24.96,47.88 v116.9,47.88
N$17  (via drill 0.4)
  Top 0.406: K6.4 135.13,76.2 133.86,74.93 133.86,65.02 | 133.86,65.02 133.86,52.2 | 133.86,52.2 133.86,42.35 135.13,41.08 K24.4 135.13,38.92 134.3,38.92 v134.18,38.8 | K12.4 133.92,64.96 133.86,65.02 | K18.4 133.92,52.26 133.86,52.2
  Bottom 0.406: v134.18,38.8 133.99,38.61 24.62,38.61 20.91,34.91 X4.4
N$18
  Top 0.406: ZD8.A D8.A
N$19
  Top 0.406: K14.12 51.09,59.72 ZD8.C 47.5,58.45 Q8.3
N$20  (via drill 0.4)
  Top 0.406: K6.9 135.13,82.17 136.4,80.9 136.4,72.26 | 136.4,72.26 136.4,59.63 | 136.4,59.63 136.4,46.74 | 136.4,46.74 v136.4,41.72 | K18.9 135.25,59.63 136.4,59.63 | K12.9 135.19,72.26 136.4,72.26 | K24.9 136.33,46.8 136.4,46.74
  Bottom 0.406: X4.3 23.35,38.72 24.19,39.56 133.29,39.56 135.45,41.72 v136.4,41.72
N$21
  Top 0.406: ZD10.C 70.14,85.12 K3.12 Q10.3
N$22
  Top 0.406: ZD9.A D9.A
N$23
  Top 0.406: ZD9.C 51.09,47.02 K20.12 52.64,45.47 52.64,36.39 51.31,35.05 Q9.3
N$24  (via drill 0.4)
  Top 0.406: K3.4 77.98,76.2 76.71,74.93 76.71,67.12 | 76.71,67.12 76.71,65.02 | 76.71,65.02 76.71,52.32 | 76.71,52.32 76.71,43.18 77.98,41.91 K21.4 | K15.4 76.77,52.26 76.71,52.32 | K9.4 76.77,64.96 76.71,65.02 | v73.72,65.22 73.72,66.36 74.55,67.18 76.64,67.18 76.71,67.12
  Bottom 0.406: X3.6 21.57,59.28 27.56,65.28 73.66,65.28 v73.72,65.22
N$25  (via drill 0.4)
  Top 0.406: K3.9 77.98,82.11 79.25,80.83 79.25,72.07 | 79.25,72.07 79.25,66.23 | 79.25,66.23 79.25,59.5 | 79.25,59.5 79.25,50.1 77.98,48.83 K21.9 | K15.9 79.25,59.5 | K9.9 78.11,72.07 79.25,72.07 | v78.8,66.17 79.18,66.17 79.25,66.23
  Bottom 0.406: X3.5 24.11,63.09 27.18,66.17 v78.8,66.17
N$26
  Top 0.406: ZD11.A D11.A
N$27
  Top 0.406: K9.12 70.14,72.42 ZD11.C 66.55,73.69 Q11.3
N$28
  Top 0.406: ZD7.A D7.A
N$29
  Top 0.406: K8.12 51.09,72.42 ZD7.C 47.5,73.69 Q7.3
N$30
  Top 0.406: ZD12.A D12.A
N$31
  Top 0.406: K15.12 70.14,59.72 ZD12.C 66.55,58.45 Q12.3
N$32
  Top 0.406: ZD6.A D6.A
N$33
  Top 0.406: ZD6.C 51.09,85.12 K2.12 Q6.3
N$34  (via drill 0.4)
  Top 0.406: K4.4 97.03,76.26 95.76,74.99 95.76,65.02 | 95.76,65.02 95.76,51.69 | 95.76,51.69 95.76,43.18 97.03,41.91 K22.4 | K10.4 95.82,64.96 95.76,65.02 | K16.4 97.03,51.63 v96.2,51.63 95.82,51.63 95.76,51.69
  Bottom 0.406: X3.8 96.16,51.66 v96.2,51.63
N$35  (via drill 0.4)
  Top 0.406: K4.9 97.03,82.17 98.3,80.9 98.3,72.26 | 98.3,72.26 98.3,59.63 | 98.3,59.63 98.3,54.42 | 98.3,54.42 98.3,50.1 97.03,48.83 K22.9 | K16.9 97.15,59.63 98.3,59.63 | K10.9 97.09,72.26 98.3,72.26 | v98.11,54.42 98.3,54.42
  Bottom 0.406: X3.7 23.07,55.48 25.97,52.58 96.27,52.58 v98.11,54.42
N$36
  Top 0.406: D13.A ZD13.A
N$37
  Top 0.406: Q13.3 70.36,35.12 71.69,36.45 71.69,45.47 K21.12 70.14,47.02 ZD13.C
N$38
  Top 0.406: D3.A ZD3.A
N$39
  Top 0.406: K7.12 32.04,72.42 ZD3.C 28.45,73.69 Q3.3
N$40
  Top 0.406: ZD14.A D14.A
N$41
  Top 0.406: ZD14.C 89.19,85.12 K4.12 Q14.3
N$42
  Top 0.406: ZD2.A D2.A
N$43
  Top 0.406: Q2.3 K1.12 32.04,85.12 ZD2.C
N$44
  Top 0.406: ZD15.A D15.A
N$45
  Top 0.406: K10.12 89.19,72.42 ZD15.C 85.6,73.69 Q15.3
N$46
  Top 0.406: ZD5.A D5.A
N$47
  Top 0.406: ZD5.C 32.04,47.02 K19.12 33.78,45.28 33.78,36.51 32.26,34.99 Q5.3
N$48
  Top 0.406: ZD16.A D16.A
N$49
  Top 0.406: K16.12 89.19,59.72 ZD16.C 85.6,58.45 Q16.3
N$50
  Top 0.406: D17.A ZD17.A
N$51
  Top 0.406: ZD17.C 89.19,47.02 K22.12 90.74,45.47 90.74,36.45 89.41,35.12 Q17.3
N$52
  Top 0.406: ZD19.A D19.A
N$53
  Top 0.406: K11.12 108.24,72.42 ZD19.C 104.65,73.69 Q19.3
N$54
  Top 0.406: ZD20.A D20.A
N$55
  Top 0.406: K17.12 108.24,59.72 ZD20.C 104.65,58.45 Q20.3
N$56
  Top 0.406: ZD21.A D21.A
N$57
  Top 0.406: ZD21.C 107.92,47.02 108.14,47.24 108.14,47.12 K23.12 109.79,45.47 109.79,36.45 108.46,35.12 Q21.3
N$58
  Top 0.406: ZD22.A D22.A
N$59
  Top 0.406: Q22.3 K6.12 127.29,85.12 ZD22.C
N$60
  Top 0.406: ZD23.A D23.A
N$61
  Top 0.406: K12.12 127.29,72.42 ZD23.C 123.7,73.69 Q23.3
N$62
  Top 0.406: ZD18.A D18.A
N$63
  Top 0.203: 108.46,85.6 K5.12
  Top 0.406: ZD18.C 108.24,85.12 K5.12 | Q18.3 108.46,85.6
N$64
  Top 0.406: ZD24.A D24.A
N$65
  Top 0.406: K18.12 127.29,59.72 ZD24.C 123.7,58.45 Q24.3
N$66
  Top 0.406: ZD25.A D25.A
N$67
  Top 0.406: ZD25.C 127.29,47.02 K24.12 128.84,45.47 128.84,36.45 127.51,35.12 Q25.3
N$68  (via drill 0.4)
  Top 0.254: X4.9 8.15,46.33 17.65,36.83 21.65,36.83 23.43,35.05 23.43,33.4 25.53,31.3 44.01,31.3 44.83,30.48 66.29,30.48 R6.2 68.83,28.89 v68.96,28.89 | v89.6,25.27 R3.2
  Bottom 0.254: v89.6,25.27 76.52,25.27 72.9,28.89 v68.96,28.89
N$69  (via drill 0.4)
  Top 0.203: RN1.5 127.94,5.57 v127.44,5.08
  Bottom 0.203: X2.9 64.68,9.62 69.79,4.51 95.63,4.51 96.52,5.4 127.13,5.4 v127.44,5.08
N$70
  Top 0.406: IC4.4 77.84,19.1 C10.2
N$71
  Top 0.203: R14.1 103.06,21.05 C17.2
N$72  (via drill 0.4)
  Top 0.203: IC2.4 102.13,17.63 v102.17,17.59 | v89.28,12.95 89.28,11.7 X2.27
  Bottom 0.203: v102.17,17.59 102.17,14.86 101.66,14.35 100.08,14.35 99,13.27 89.6,13.27 v89.28,12.95
N$73
  Top 0.203: IC5.4 101.08,22.88 R14.2
N$74
  Top 0.203: R7.1 | IC6.7 85.47,26.09 C11.1
  Top 0.254: R7.1 C11.1
N$75  (via drill 0.4)
  Top 0.203: IC1.33 129.63,17.37 v129.86,17.14 | v131.38,17.14 131.7,16.83 v131.7,7.18 | DIB1.1.COM v65.47,17.53
  Bottom 0.203: v129.86,17.14 v131.38,17.14 | v131.7,7.18 129.67,5.14 128.4,5.14 127.7,5.84 96.33,5.84 95.44,4.95 72.77,4.95 68.45,9.27 68.45,15.88 66.8,17.53 v65.47,17.53
N$76
  Top 0.203: C16.2 R9.1 | R9.1 R10.2 | IC6.2 76.83,26.09 R9.1
N$78
  Top 0.203: C16.1 74.11,27.31 R13.1 77.85,27.36 IC6.1
N$80  (via drill 0.4)
  Top 0.406: K6.5 v137.67,79.76 | K5.5 v118.62,79.69 | K4.5 v99.57,79.69 | K3.5 v80.52,79.69 | K2.5 v61.47,79.69 | K1.5 v42.42,79.69
  Bottom 0.406: 42.48,80.83 11.96,80.83 X3.10 | 42.48,80.83 61.4,80.83 | 61.4,80.83 80.52,80.83 | 80.52,80.83 99.69,80.83 | 99.69,80.83 118.68,80.83 | 118.68,80.83 136.59,80.83 v137.67,79.76 | v118.62,79.69 118.62,80.77 118.68,80.83 | v99.57,79.69 99.57,80.71 99.69,80.83 | v80.52,79.69 80.52,80.83 | v61.47,79.69 61.47,80.77 61.4,80.83 | v42.42,79.69 42.42,80.77 42.48,80.83
N$81  (via drill 0.4)
  Top 0.406: K6.8 v137.67,82.8 | K5.8 v118.62,82.87 | K4.8 v99.57,82.87 | K3.8 v80.52,82.87 | K2.8 v61.47,82.87 | K1.8 v42.42,82.87
  Bottom 0.406: 42.35,81.72 9.04,81.72 X3.9 | 42.35,81.72 61.47,81.72 | 61.47,81.72 80.45,81.72 | 80.45,81.72 99.57,81.72 | 99.57,81.72 118.56,81.72 | 118.56,81.72 136.59,81.72 v137.67,82.8 | v118.62,82.87 118.62,81.79 118.56,81.72 | v99.57,82.87 99.57,81.72 | v80.52,82.87 80.52,81.79 80.45,81.72 | v61.47,82.87 61.47,81.72 | v42.42,82.87 42.42,81.79 42.35,81.72
N$82
  Top 1.778: X4.7 23.01,23.48 25.27,21.21 29.84,21.21 32.51,23.87 K_PWR.11B
N$84
  Bottom 1.778: X4.8 23.98,19.66 25.53,21.21 35.31,21.21 37.55,23.45 K_PWR.12B
N$86  (via drill 0.4)
  Top 0.254: X4.11 8.15,38.71 13.84,33.02 23.11,33.02 25.34,30.8 43.81,30.8 44.64,29.97 63.31,29.97 v64.39,28.89 R12.2 | R9.2 v71.44,25.27
  Bottom 0.254: v64.39,28.89 68.01,25.27 v71.44,25.27
N$94
  Bottom 1.778: X4.6 25.11,27.29 K_PWR.14B
N$95
  Bottom 1.778: K_PWR.11A 32.51,16.7 29.53,13.72 20.45,13.72 10.69,23.48 X4.15
N$96
  Bottom 1.778: K_PWR.12A 37.55,15.32 32.38,10.16 18.92,10.16 9.42,19.66 X4.16
N$97
  Top 1.778: K_PWR.14A 27.27,17.37 25.46,15.56 18.54,15.56 13.53,20.57 13.53,24.83 11.07,27.29 X4.14
N$98
  Top 0.406: D1.A ZD1.A
N$99  (via drill 0.4)
  Top 0.203: RN1.6 128.84,5.96 v128.78,5.91
  Bottom 0.203: v128.78,5.91 128.4,6.29 96.14,6.29 95.25,5.4 74.32,5.4 X2.13
N$100
  Top 0.406: K_PWR.A1 52.85,25.11 ZD1.C 56.39,26.67 Q1.3
N$101  (via drill 0.4)
  Top 0.203: RN1.7 v129.74,6.42 v129.73,6.41
  Bottom 0.203: X2.14 71.06,11.2 71.06,9.34 74.55,5.84 95.06,5.84 95.95,6.73 129.41,6.73 v129.73,6.41
N$102  (via drill 0.4)
  Top 0.203: RN1.8 130.64,7.19 v130.62,7.18
  Bottom 0.203: v130.62,7.18 95.76,7.18 94.87,6.29 74.74,6.29 72.33,8.7 72.33,9.93 X2.15
N$246
  Top 0.203: C12.2 102.96,27.53 R8.1
N$251
  Top 0.203: R4.2 R3.1 | IC6.6 86.17,24.82 R3.1 | C11.2 88.52,27.17 R3.1
N$252
  Top 0.203: R8.2 101.16,25.89 IC5.6
OUT0  (via drill 0.4)
  Top 0.203: RN3.8 54.31,88.06 v54.29,88.08 | v33.27,88.14 Q2.1 33.27,91.5 35.12,93.34 138.94,93.34 144.27,88.01 144.27,17.72 142.94,16.38 v142.94,16.32 | IC1.10 122.16,14.38 v123.2,15.39
  Bottom 0.203: 33.34,88.08 v33.27,88.14 33.66,88.52 53.59,88.52 54.04,88.08 v54.29,88.08 | v142.94,16.32 142.81,16.19 133.79,16.19 133.16,15.56 123.34,15.56 v123.2,15.39
OUT1  (via drill 0.4)
  Top 0.203: 143.83,15.62 v143.64,15.43 144.78,16.57 144.78,88.14 139.13,93.79 31.69,93.79 29.46,91.57 Q3.1 29.59,90.04 v29.59,88.96 | RN3.7 v55.25,88.96 v55.24,88.96 | IC1.11 119.7,13.84 122.3,13.84 v122.81,13.34
  Bottom 0.203: v55.24,88.96 v29.59,88.96 | v143.64,15.43 142.75,15.43 142.43,15.75 133.99,15.75 133.35,15.11 123.95,15.11 122.81,13.97 v122.81,13.34
OUT2  (via drill 0.4)
  Top 0.203: Q4.1 v27.43,33.97 | RN6.8 35.83,32.18 34.42,33.59 v34.42,35.5 | IC1.12 119.37,13.39 119.37,13.01 118.24,11.87 115.13,11.87 113.22,13.78 113.22,33.97 114.24,34.99 v114.24,35.5
  Bottom 0.203: 34.35,35.81 29.27,35.81 v27.43,33.97 | 34.35,35.81 113.92,35.81 v114.24,35.5 | v34.42,35.5 34.42,35.75 34.35,35.81
OUT3  (via drill 0.4)
  Top 0.203: Q5.1 v31.24,33.97 | RN6.7 36.01,33.08 v35.56,33.53 | v113.22,35.05 113.22,34.61 112.78,34.16 112.78,13.59 114.94,11.43 121.14,11.43 IC1.13
  Bottom 0.203: 34.8,34.73 35.43,35.37 112.9,35.37 v113.22,35.05 | 34.8,34.73 32,34.73 v31.24,33.97 | 34.8,34.73 34.8,34.29 v35.56,33.53
OUT4  (via drill 0.4)
  Top 0.203: Q6.1 52.32,91.57 53.21,92.46 56.77,92.46 | 56.77,92.46 138.56,92.46 143.26,87.76 143.26,18.35 141.73,16.83 141.73,14.67 141.41,14.35 141.41,13.27 v141.6,13.08 | RN3.5 56.77,90.76 56.77,92.46 | IC1.14 121.63,11.01 121.16,10.54 121.16,9.59 v121.22,9.46
  Bottom 0.203: v141.6,13.08 140.27,13.08 139.38,12.19 125.03,12.19 122.3,9.46 v121.22,9.46
OUT5  (via drill 0.4)
  Top 0.203: Q7.1 48.51,91.63 48.55,91.66 | 48.55,91.66 49.78,92.9 138.75,92.9 143.76,87.88 143.76,18.22 142.18,16.64 v142.18,14.03 | RN3.6 55.56,89.86 v53.78,91.63 | v49.02,91.57 48.64,91.57 48.55,91.66 | IC1.15 122.14,10.45 v121.92,10.22
  Bottom 0.203: v53.78,91.63 49.28,91.63 v49.02,91.57 | v142.18,14.03 141.48,14.03 140.97,13.53 140.08,13.53 139.19,12.64 124.84,12.64 122.49,10.29 121.98,10.29 v121.92,10.22
OUT6  (via drill 0.4)
  Top 0.203: Q8.1 v46.48,34.61 | RN6.5 36.05,34.88 v35.75,34.61 | IC1.16 122.64,9.74 121.6,8.7 117.03,8.7 112.33,13.4 112.33,34.48 v112.2,34.61
  Bottom 0.203: v35.75,34.61 36.07,34.92 46.16,34.92 v46.48,34.61 46.8,34.92 111.89,34.92 v112.2,34.61
OUT7  (via drill 0.4)
  Top 0.203: Q9.1 v50.29,33.97 | RN6.6 v36.65,33.98 v36.64,33.97 | IC1.17 123.13,9.59 121.79,8.26 116.84,8.26 111.89,13.21 111.89,33.78 111.51,34.16 v111.19,34.16
  Bottom 0.203: v36.64,33.97 37.08,34.42 45.59,34.42 46.23,33.78 46.67,33.78 47.37,34.48 49.78,34.48 v50.29,33.97 50.8,34.48 110.87,34.48 v111.19,34.16
OUT8  (via drill 0.4)
  Top 0.203: Q10.1 71.37,90.68 72.26,91.57 82.93,91.57 | 82.93,91.57 138.18,91.57 142.24,87.5 142.24,18.61 140.78,17.14 140.78,14.99 140.4,14.61 140.4,12.83 140.08,12.51 140.08,11.56 v140.27,11.3 | RN4.7 v93.03,88.96 | v83,88.65 83,91.5 82.93,91.57 | IC1.18 123.64,9.72 v123.89,9.46
  Bottom 0.203: v93.03,88.96 92.39,88.96 91.19,87.76 83.88,87.76 v83,88.65 | v123.89,9.46 124.14,9.72 124.71,9.72 125.22,10.22 125.22,10.99 125.54,11.3 v140.27,11.3
OUT9  (via drill 0.4)
  Top 0.203: RN4.8 93.96,88.06 v93.92,88.01 | v67.56,89.03 Q11.1 67.56,91.06 68.52,92.01 138.37,92.01 142.75,87.63 142.75,18.48 141.22,16.95 141.22,14.8 140.84,14.41 140.84,12.32 v140.91,12.26 | 124.21,10.6 v124.4,10.48 124.14,10.67 IC1.19
  Bottom 0.203: v93.92,88.01 92.14,88.01 91.38,87.25 83.31,87.25 81.92,88.65 67.94,88.65 v67.56,89.03 | v140.91,12.26 140.72,12.06 139.89,12.06 139.57,11.75 125.35,11.75 124.4,10.79 v124.4,10.48
OUT10  (via drill 0.4)
  Top 0.203: v66.23,32.7 Q12.1 65.53,32.07 66.17,31.43 69.22,31.43 69.6,31.05 72.45,31.05 74.62,33.22 RN7.6 | v130.18,33.72 135.7,28.19 135.7,16.38 v134.3,14.99 | IC1.20 124.65,12.89 123.76,13.78 v123.76,13.91
  Bottom 0.203: v66.23,32.7 67.56,34.04 109.47,34.04 110.17,33.34 129.79,33.34 v130.18,33.72 | 134.24,14.92 v134.3,14.99 133.99,14.67 124.59,14.67 v123.76,13.91
OUT11  (via drill 0.4)
  Top 0.203: v70.04,32.7 Q13.1 69.34,32 69.79,31.56 72.26,31.56 74.82,34.12 RN7.5 | IC1.39 125.64,22.44 v125.48,22.61 | v110.36,24.19 v110.36,30.86
  Bottom 0.203: v70.04,32.7 70.1,32.7 70.99,33.59 102.62,33.59 105.03,31.18 110.05,31.18 v110.36,30.86 | v125.48,22.61 124.21,23.88 110.68,23.88 v110.36,24.19
OUT12  (via drill 0.4)
  Top 0.203: v89.72,90.17 Q14.1 90.42,90.76 RN4.5 | IC1.40 125.13,19.27 v125.41,18.99
  Bottom 0.203: v89.72,90.17 89.72,90.55 92.27,93.09 138.81,93.09 144.08,87.82 144.08,24.45 138.43,18.8 125.6,18.8 v125.41,18.99
OUT13  (via drill 0.4)
  Top 0.203: Q15.1 v85.92,90.17 | RN4.6 v93.8,89.86 v93.79,89.85 | IC1.41 124.65,19.24 v124.33,18.92
  Bottom 0.203: v93.79,89.85 92.65,89.85 91,88.2 87.88,88.2 v85.92,90.17 85.92,90.55 88.9,93.53 139,93.53 144.53,88.01 144.53,24.26 138.62,18.35 126.17,18.35 125.98,18.16 125.09,18.16 v124.33,18.92
OUT14  (via drill 0.4)
  Top 0.203: IC1.42 124.14,21.27 124.4,21.53 v124.4,22.61 | RN7.2 84.58,32.32 Q16.1 v85.09,32.7 | v109.6,25.02 109.6,30.1 v109.28,30.42
  Bottom 0.203: v85.09,32.7 85.53,33.15 102.42,33.15 104.84,30.73 108.97,30.73 v109.28,30.42 | v109.6,25.02 109.6,23.88 110.05,23.43 123.57,23.43 v124.4,22.61
OUT15  (via drill 0.4)
  Top 0.203: IC1.43 v123.64,21.84 | RN7.1 87.74,31.42 88.33,32 88.33,32.07 88.39,32.13 88.39,32.38 | Q17.1 88.39,32.38 | 88.39,32.38 v88.96,32.38 | v108.2,29.97 108.2,25.02 v108.46,24.77
  Bottom 0.203: v88.96,32.38 89.28,32.7 102.23,32.7 104.65,30.29 107.89,30.29 v108.2,29.97 | v123.64,21.84 122.49,22.99 109.86,22.99 108.46,24.38 v108.46,24.77
OUT16  (via drill 0.4)
  Top 0.203: v120.9,88.84 120.02,89.72 109.47,89.72 109.41,89.66 109.41,90.11 Q18.1 109.47,90.49 109.54,90.55 v108.78,90.55 | RN5.7 v131.9,88.96 v131.89,88.96 | IC1.45 122.64,21.93 124.08,23.37 v128.02,23.37
  Bottom 0.203: v108.78,90.55 108.78,90.68 110.3,92.2 138.43,92.2 143.19,87.44 143.19,29.21 134.81,20.83 128.71,20.83 128.02,21.53 v128.02,23.37 | v120.9,88.84 122.36,87.38 130.3,87.38 v131.89,88.96
OUT17  (via drill 0.4)
  Top 0.203: Q19.1 v104.97,90.17 | RN5.8 132.13,88.06 v131.95,87.88 | IC1.46 122.14,22.06 123.89,23.81 126.36,23.81 v126.68,24.13
  Bottom 0.203: v131.95,87.88 131.44,87.88 130.49,86.93 122.17,86.93 121.03,88.08 120.59,88.08 119.83,88.84 106.3,88.84 v104.97,90.17 104.97,91 106.62,92.65 138.62,92.65 143.64,87.63 143.64,28.96 135.06,20.38 128.52,20.38 127.57,21.34 127.57,22.73 126.68,23.62 v126.68,24.13
OUT18  (via drill 0.4)
  Top 0.203: Q20.1 103.69,32.7 v104.27,33.27 | v135.45,14.99 136.14,15.68 136.14,28.45 131.57,33.02 v131.57,33.47 | RN8.5 115.52,34.12 v113.98,32.58 | IC1.21 125.13,13.04 124.84,13.34 v124.84,13.91
  Bottom 0.203: v104.27,33.27 104.58,33.59 109.28,33.59 109.98,32.89 113.98,32.89 | 113.98,32.89 131,32.89 v131.57,33.47 | v135.45,14.99 134.68,14.22 125.22,14.22 v124.84,13.91 | v113.98,32.58 113.98,32.89
OUT19  (via drill 0.4)
  Top 0.203: Q21.1 v106.87,32.7 | v136.59,14.99 136.59,28.7 134.81,30.48 v134.81,30.86 | RN8.6 115.32,33.21 115,32.89 v115,32.07 | IC1.22 125.64,13.18 v125.79,13.4
  Bottom 0.203: v106.87,32.7 107.31,33.15 109.09,33.15 109.79,32.45 113.03,32.45 113.67,31.81 114.75,31.81 v115,32.07 115,32.13 115.32,32.45 132.78,32.45 134.37,30.86 v134.81,30.86 | v136.59,14.99 135.38,13.78 126.24,13.78 v125.79,13.4
OUT20  (via drill 0.4)
  Top 0.203: v127.83,90.17 Q22.1 128.52,90.76 RN5.5 | IC1.35 128.94,18.39 129.22,18.67 129.22,20.64 130.18,21.59 v130.18,22.04
  Bottom 0.203: v127.83,90.17 128.97,91.31 138.05,91.31 142.3,87.06 142.3,29.59 134.43,21.72 130.49,21.72 v130.18,22.04
OUT21  (via drill 0.4)
  Top 0.203: Q23.1 v124.02,90.17 | RN5.6 130.18,89.86 v130.05,89.72 | 128.12,18.86 IC1.36 128.1,20.6 v129.09,21.59
  Bottom 0.203: v130.05,89.72 129.98,89.72 128.91,88.65 125.54,88.65 v124.02,90.17 124.02,90.42 125.35,91.76 138.24,91.76 142.75,87.25 142.75,29.4 134.62,21.27 129.41,21.27 v129.09,21.59
OUT22  (via drill 0.4)
  Top 0.203: Q24.1 121.39,31.42 RN8.1 117.94,27.2 113.98,23.24 v113.98,18.8 | IC1.2 118.71,18.39 v118.3,18.8
  Bottom 0.203: 118.05,18.54 v118.3,18.8 117.98,18.48 114.3,18.48 v113.98,18.8
OUT23  (via drill 0.4)
  Top 0.203: Q25.1 126.49,32.51 126.43,32.45 | Q25.1 126.49,31.62 128.14,29.97 133.29,29.97 135.25,28 135.25,17.84 v134.81,17.4 | v126.49,34.1 Q25.1 | RN8.2 119.25,32.32 v121.03,34.1 | v122.43,16.85 121.4,17.88 IC1.3
  Bottom 0.203: 134.49,17.72 v134.81,17.4 134.3,17.91 126.36,17.91 125.09,16.64 122.68,16.64 v122.43,16.85 | v121.03,34.1 121.35,33.78 126.17,33.78 v126.49,34.1
PWM#1  (via drill 0.4)
  Top 0.203: R5.2 99.2,27.35 99.2,26.3 v99.19,26.29 99.19,25.82 IC5.1 | v130.62,19.56 130.62,16.7 129.29,15.37 IC1.29
  Bottom 0.203: v130.62,19.56 130.24,19.94 128.33,19.94 127.83,20.45 123.95,20.45 121.86,22.54 109.6,22.54 106.24,25.91 99.57,25.91 v99.19,26.29
PWM#2  (via drill 0.4)
  Top 0.203: IC5.3 99.12,24.41 99.12,24.01 v99.12,23.94 99.12,24 R11.2 | IC1.32 126.94,16.89 v126.68,17.14 | v108.65,15.24 108.65,15.75 107.25,17.14 107.25,22.1 v105.41,23.94
  Bottom 0.203: v99.12,23.94 v105.41,23.94 | v126.68,17.14 126.43,16.89 125.98,16.89 125.2,16.1 118.75,16.1 118.26,15.62 109.03,15.62 v108.65,15.24
SWCLK
  Top 0.203: IC1.37 126.63,20.78 128.78,22.92 128.78,23.69 127.51,24.96 123.13,24.96 122.05,26.04 X1.2
SWDIO
  Top 0.203: IC1.34 129.07,17.88 129.67,18.48 129.67,20.45 130.94,21.72 130.94,22.35 127.13,26.16 X1.4
UART_RX  (via drill 0.4)
  Top 0.203: IC1.31 125.54,16.38 125.35,16.57 125.35,17.72 124.9,18.16 123.83,18.16 v123.7,18.03
  Bottom 0.203: v123.7,18.03 106.68,18.03 102.55,13.91 100.27,13.91 99.19,12.83 90.23,12.83 89.6,12.19 87.85,12.19 X2.28 87.78,12.26
UART_TX  (via drill 0.4)
  Top 0.203: RN2.1 102.76,13.16 102.74,13.14 v101.98,13.14 101.98,14.41 v101.28,15.11 | v100.08,18.29 IC2.2 | IC1.30 125.41,15.88 124.9,16.38 124.9,17.08 v124.59,17.4
  Bottom 0.203: v124.59,17.4 124.46,17.27 123.38,17.27 123.06,17.59 106.87,17.59 102.42,13.14 v101.98,13.14 | v101.28,15.11 100.52,15.88 100.27,16.13 100.08,16.32 v100.08,18.29

## Text on the board
tPlace: 2 SWCLK / 3 Gnd / 4 SWDIO | EEZ DIB SMX46 / (09/2020 r1B3)
bPlace: EEZ DIB SMX46 (09/2020 r1B3) / Project source code: github.com/eez-open | EEZ DIB